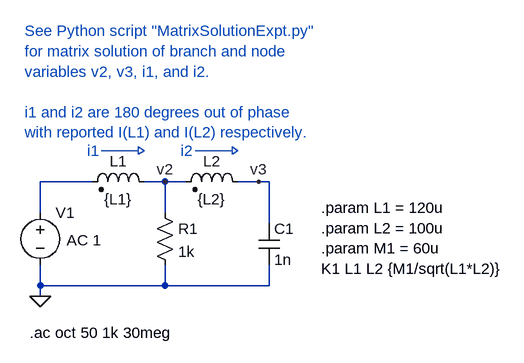
[diagram p0: schematic MatrixSolnExptSwept.asc]
MatrixSolnExptSwept.asc, the LTspice schematic file:
Version 4
SHEET 1 880 680
WIRE 192 96 112 96
WIRE 304 96 272 96
WIRE 336 96 304 96
WIRE 448 96 416 96
WIRE 464 96 448 96
WIRE 112 144 112 96
WIRE 304 144 304 96
WIRE 464 160 464 96
WIRE 112 256 112 224
WIRE 304 256 304 224
WIRE 304 256 112 256
WIRE 464 256 464 224
WIRE 464 256 304 256
WIRE 112 272 112 256
FLAG 304 96 v2
FLAG 448 96 v3
FLAG 112 272 0
SYMBOL voltage 112 128 R0
WINDOW 123 41 58 Left 2
WINDOW 39 0 0 Left 2
SYMATTR Value2 AC 1
SYMATTR InstName V1
SYMATTR Value ""
SYMBOL ind2 288 112 M270
WINDOW 0 32 56 VTop 2
WINDOW 3 5 56 VBottom 2
SYMATTR InstName L1
SYMATTR Value {L1}
SYMATTR Type ind
SYMBOL ind2 432 112 M270
WINDOW 0 32 56 VTop 2
WINDOW 3 5 56 VBottom 2
SYMATTR InstName L2
SYMATTR Value {L2}
SYMATTR Type ind
SYMBOL res 288 128 R0
SYMATTR InstName R1
SYMATTR Value 1k
SYMBOL cap 448 160 R0
SYMATTR InstName C1
SYMATTR Value 1n
TEXT 544 136 Left 2 !.param L1 = 120u\n.param L2 = 100u\n.param M1 = 60u\nK1 L1 L2 {M1/sqrt(L1*L2)}
TEXT 88 -136 Left 2 ;See Python script "MatrixSolutionExpt.py"\nfor matrix solution of branch and node\nvariables v2, v3, i1, and i2.\n \ni1 and i2 are 180 degrees out of phase\nwith reported I(L1) and I(L2) respectively.
TEXT 184 48 Left 2 ;i1
TEXT 328 48 Left 2 ;i2
TEXT 96 328 Left 2 !.ac oct 50 1k 30meg
LINE Normal 263 48 206 48
LINE Normal 272 48 272 48 2
LINE Normal 272 48 272 48 2
LINE Normal 272 48 272 48 2
LINE Normal 263 42 272 48
LINE Normal 263 42 263 42 2
LINE Normal 263 42 263 42 2
LINE Normal 263 54 263 42
LINE Normal 272 48 263 54
LINE Normal 272 48 272 48 2
LINE Normal 407 48 350 48
LINE Normal 416 48 416 48 2
LINE Normal 416 48 416 48 2
LINE Normal 416 48 416 48 2
LINE Normal 407 42 416 48
LINE Normal 407 42 407 42 2
LINE Normal 407 42 407 42 2
LINE Normal 407 54 407 42
LINE Normal 416 48 407 54
LINE Normal 416 48 416 48 2

The netlist it stands for:
* MatrixSolnExptSwept.asc
V1 N001 0 AC 1
L1 v2 N001 {L1}
L2 v3 v2 {L2}
R1 v2 0 1k
C1 v3 0 1n
.param L1 = 120u
.param L2 = 100u
.param M1 = 60u
K1 L1 L2 {M1/sqrt(L1*L2)}
* See Python script "MatrixSolutionExpt.py"
* for matrix solution of branch and node
* variables v2, v3, i1, and i2.
* i1 and i2 are 180 degrees out of phase
* with reported I(L1) and I(L2) respectively.
* i1
* i2
.ac oct 50 1k 30meg
.backanno
.end